# EAGLE schematic EZFOC_V1 (EAGLE 9.6.2)
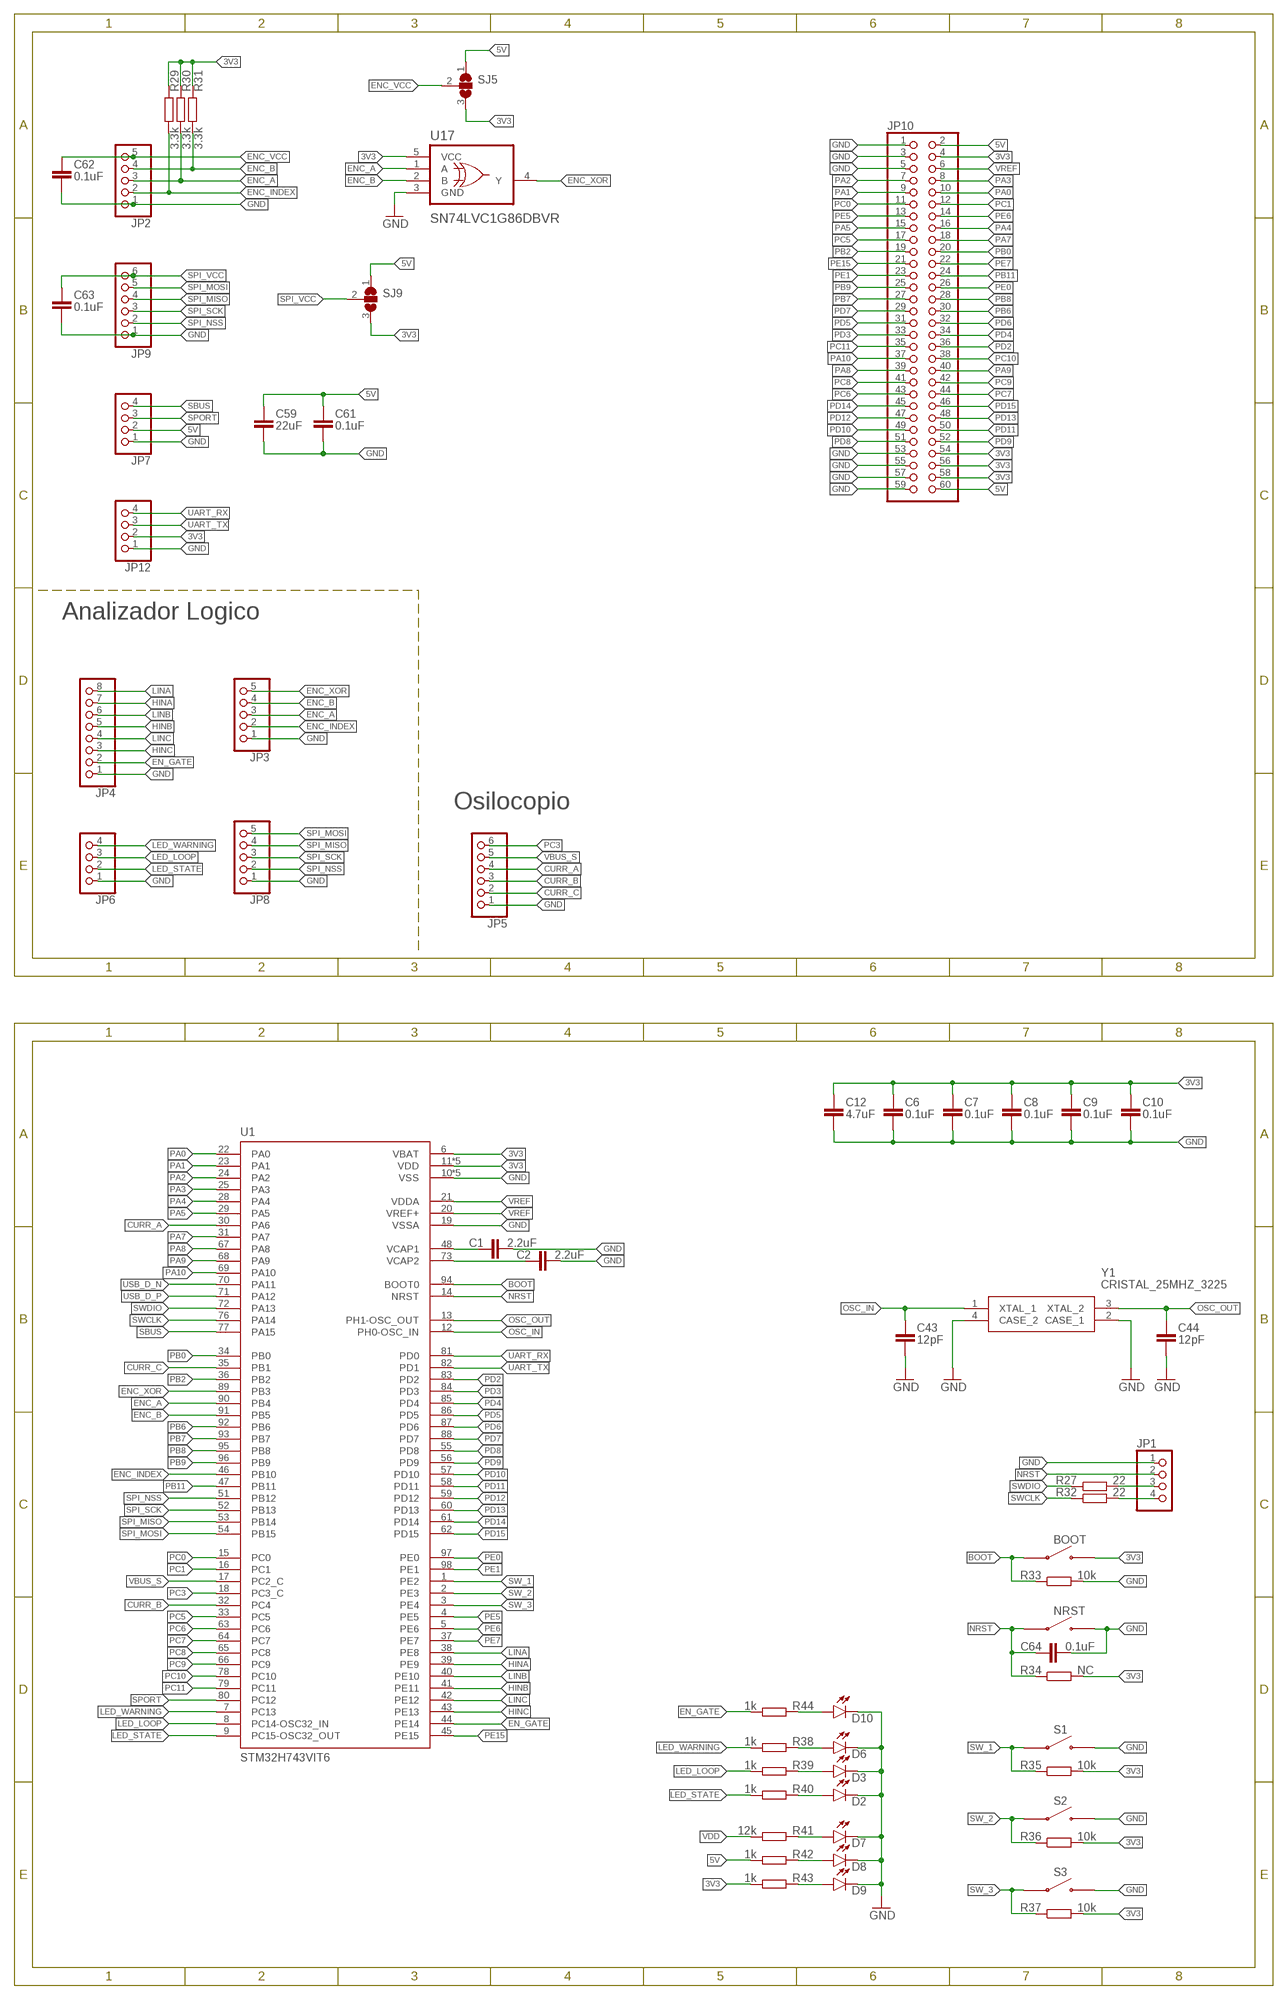
[diagram p0: schematic, sheet 1, part 1 of 2]
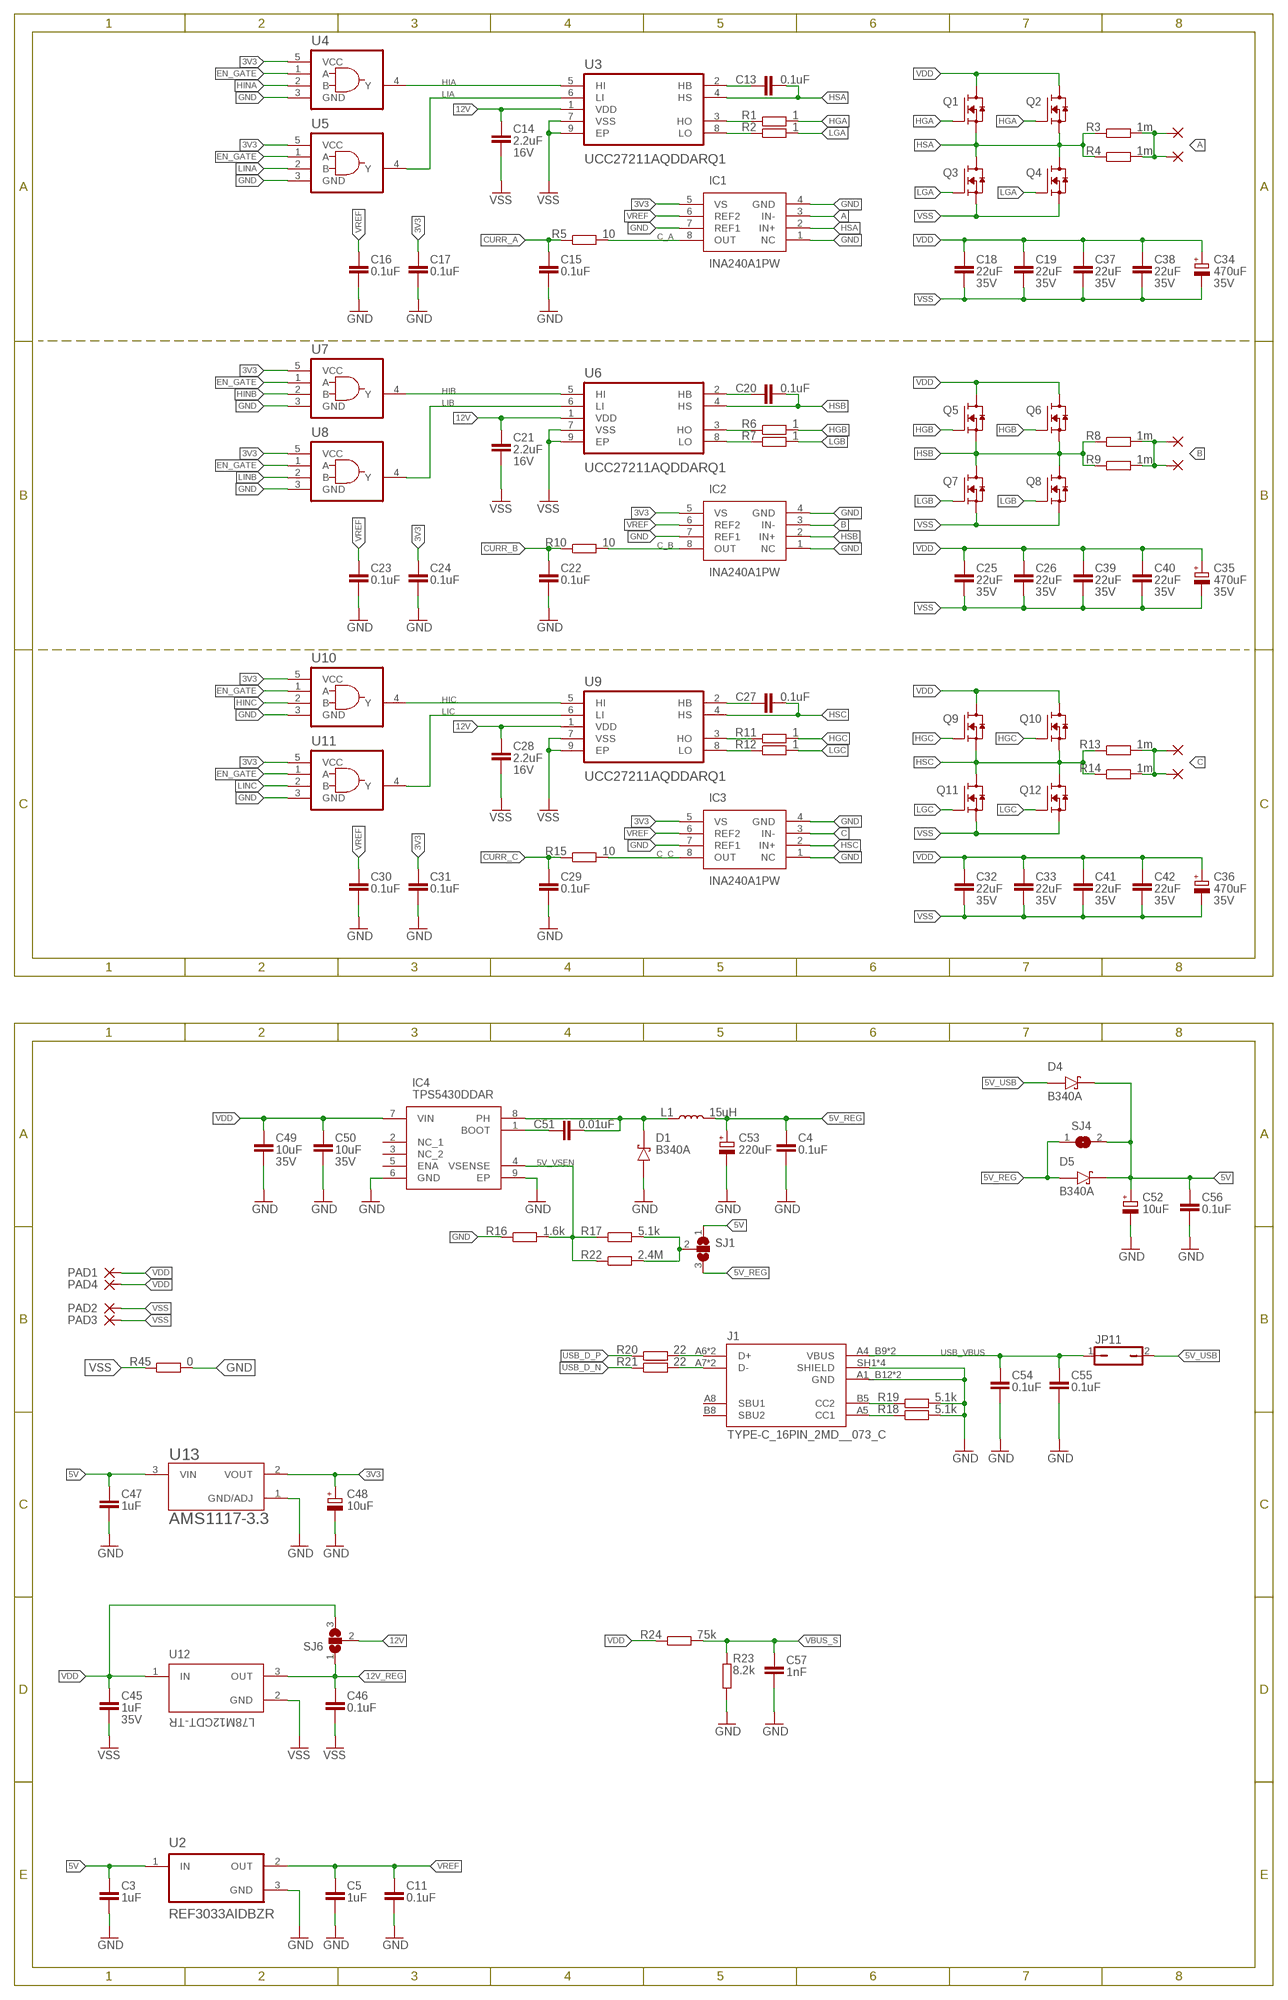
[diagram p1: schematic, sheet 1, part 2 of 2]

## Parts
A  PAD1.27X2.54  [SMD1,27-2,54]
A1  PAD1.27X2.54  [SMD1,27-2,54]
B  PAD1.27X2.54  [SMD1,27-2,54]
B1  PAD1.27X2.54  [SMD1,27-2,54]
BOOT  TS-1088  [SKRKAEE020]
C  PAD1.27X2.54  [SMD1,27-2,54]
C1  2.2uF  C_CHIP-0603(1608-METRIC)  [0603]
C2  2.2uF  C_CHIP-0603(1608-METRIC)  [0603]
C3  1uF  C_CHIP-0603(1608-METRIC)  [0603]
C4  0.1uF  C_CHIP-0402(1005-METRIC)  [0402]
C5  1uF  C_CHIP-0603(1608-METRIC)  [0603]
C6  0.1uF  C_CHIP-0402(1005-METRIC)  [0402]
C7  0.1uF  C_CHIP-0402(1005-METRIC)  [0402]
C8  0.1uF  C_CHIP-0402(1005-METRIC)  [0402]
C9  0.1uF  C_CHIP-0402(1005-METRIC)  [0402]
C10  0.1uF  C_CHIP-0402(1005-METRIC)  [0402]
C11  0.1uF  C_CHIP-0402(1005-METRIC)  [0402]
C12  4.7uF  C_CHIP-0603(1608-METRIC)  [0603]
C13  0.1uF  C_CHIP-0603(1608-METRIC)  [0603]
C14  2.2uF  C_CHIP-0603(1608-METRIC)  [0603]
C15  0.1uF  C_CHIP-0402(1005-METRIC)  [0402]
C16  0.1uF  C_CHIP-0402(1005-METRIC)  [0402]
C17  0.1uF  C_CHIP-0402(1005-METRIC)  [0402]
C18  22uF  C_CHIP-1206(3216-METRIC)  [1206]
C19  22uF  C_CHIP-1206(3216-METRIC)  [1206]
C20  0.1uF  C_CHIP-0603(1608-METRIC)  [0603]
C21  2.2uF  C_CHIP-0603(1608-METRIC)  [0603]
C22  0.1uF  C_CHIP-0402(1005-METRIC)  [0402]
C23  0.1uF  C_CHIP-0402(1005-METRIC)  [0402]
C24  0.1uF  C_CHIP-0402(1005-METRIC)  [0402]
C25  22uF  C_CHIP-1206(3216-METRIC)  [1206]
C26  22uF  C_CHIP-1206(3216-METRIC)  [1206]
C27  0.1uF  C_CHIP-0603(1608-METRIC)  [0603]
C28  2.2uF  C_CHIP-0603(1608-METRIC)  [0603]
C29  0.1uF  C_CHIP-0402(1005-METRIC)  [0402]
C30  0.1uF  C_CHIP-0402(1005-METRIC)  [0402]
C31  0.1uF  C_CHIP-0402(1005-METRIC)  [0402]
C32  22uF  C_CHIP-1206(3216-METRIC)  [1206]
C33  22uF  C_CHIP-1206(3216-METRIC)  [1206]
C34  470uF  C-POL_ECAP-10.5MM  [CAPAE1030X1050N]
C35  470uF  C-POL_ECAP-10.5MM  [CAPAE1030X1050N]
C36  470uF  C-POL_ECAP-10.5MM  [CAPAE1030X1050N]
C37  22uF  C_CHIP-1206(3216-METRIC)  [1206]
C38  22uF  C_CHIP-1206(3216-METRIC)  [1206]
C39  22uF  C_CHIP-1206(3216-METRIC)  [1206]
C40  22uF  C_CHIP-1206(3216-METRIC)  [1206]
C41  22uF  C_CHIP-1206(3216-METRIC)  [1206]
C42  22uF  C_CHIP-1206(3216-METRIC)  [1206]
C43  12pF  C_CHIP-0402(1005-METRIC)  [0402]
C44  12pF  C_CHIP-0402(1005-METRIC)  [0402]
C45  1uF  C_CHIP-0603(1608-METRIC)  [0603]
C46  0.1uF  C_CHIP-0402(1005-METRIC)  [0402]
C47  1uF  C_CHIP-0603(1608-METRIC)  [0603]
C48  10uF  C-POL_TANTALUM-1206(3216-METRIC)  [CAPMP3216X180N]
C49  10uF  C_CHIP-0805(2012-METRIC)  [0805]
C50  10uF  C_CHIP-0805(2012-METRIC)  [0805]
C51  0.01uF  C_CHIP-0603(1608-METRIC)  [0603]
C52  10uF  C-POL_TANTALUM-1206(3216-METRIC)  [CAPMP3216X180N]
C53  220uF  C-POL_ECAP-6.3MM  [CAPAE660X800N]
C54  0.1uF  C_CHIP-0402(1005-METRIC)  [0402]
C55  0.1uF  C_CHIP-0402(1005-METRIC)  [0402]
C56  0.1uF  C_CHIP-0402(1005-METRIC)  [0402]
C57  1nF  C_CHIP-0402(1005-METRIC)  [0402]
C59  22uF  C_CHIP-1206(3216-METRIC)  [1206]
C61  0.1uF  C_CHIP-0402(1005-METRIC)  [0402]
C62  0.1uF  C_CHIP-0402(1005-METRIC)  [0402]
C63  0.1uF  C_CHIP-0402(1005-METRIC)  [0402]
C64  0.1uF  C_CHIP-0402(1005-METRIC)  [0402]
C65  PAD1.27X2.54  [SMD1,27-2,54]
D1  B340A  B340A-13-F  [DIOM5226X240N]
D2  LED_BLUE  CHIP-FLAT-B_0805  [LEDC2012X110N_FLAT-B]
D3  LED_BLUE  CHIP-FLAT-B_0805  [LEDC2012X110N_FLAT-B]
D4  B340A  B340A-13-F  [DIOM5226X240N]
D5  B340A  B340A-13-F  [DIOM5226X240N]
D6  LED_BLUE  CHIP-FLAT-B_0805  [LEDC2012X110N_FLAT-B]
D7  LED_BLUE  CHIP-FLAT-B_0805  [LEDC2012X110N_FLAT-B]
D8  LED_BLUE  CHIP-FLAT-B_0805  [LEDC2012X110N_FLAT-B]
D9  LED_BLUE  CHIP-FLAT-B_0805  [LEDC2012X110N_FLAT-B]
D10  LED_BLUE  CHIP-FLAT-B_0805  [LEDC2012X110N_FLAT-B]
IC1  INA240A1PW  [SOP65P640X120-8N]
IC2  INA240A1PW  [SOP65P640X120-8N]
IC3  INA240A1PW  [SOP65P640X120-8N]
IC4  TPS5430DDAR  [SOIC127P600X170-9N]
J1  TYPE-C_16PIN_2MD__073_C  [GCT_USB4105-GF-A]
JP1  PINHD-1X4  [1X04]
JP2  PINHD-1X5  [1X05]
JP3  PINHD-1X5  [1X05]
JP4  PINHD-1X8  [1X08]
JP5  PINHD-1X6  [1X06]
JP6  PINHD-1X4  [1X04]
JP7  PINHD-1X4  [1X04]
JP8  PINHD-1X5  [1X05]
JP9  PINHD-1X6  [1X06]
JP10  PINHD-2X30  [2X30]
JP11  JP1Q  [JP1]
JP12  PINHD-1X4  [1X04]
L1  15uH  LSMD6.6X7.3MM  [SMD6.6X7.3MM]
NRST  TS-1088  [SKRKAEE020]
PAD1  PAD2.54X5.08  [SMD2,54-5,08]
PAD2  PAD2.54X5.08  [SMD2,54-5,08]
PAD3  PAD2.54X5.08  [SMD2,54-5,08]
PAD4  PAD2.54X5.08  [SMD2,54-5,08]
Q1  BSC011N03LSI_FL  [TDSON-8FL]
Q2  BSC011N03LSI_FL  [TDSON-8FL]
Q3  BSC011N03LSI_FL  [TDSON-8FL]
Q4  BSC011N03LSI_FL  [TDSON-8FL]
Q5  BSC011N03LSI_FL  [TDSON-8FL]
Q6  BSC011N03LSI_FL  [TDSON-8FL]
Q7  BSC011N03LSI_FL  [TDSON-8FL]
Q8  BSC011N03LSI_FL  [TDSON-8FL]
Q9  BSC011N03LSI_FL  [TDSON-8FL]
Q10  BSC011N03LSI_FL  [TDSON-8FL]
Q11  BSC011N03LSI_FL  [TDSON-8FL]
Q12  BSC011N03LSI_FL  [TDSON-8FL]
R1  1  R_CHIP-0603(1608-METRIC)  [0603]
R2  1  R_CHIP-0603(1608-METRIC)  [0603]
R3  1m  R_CHIP-2512(6332-METRIC)  [2512]
R4  1m  R_CHIP-2512(6332-METRIC)  [2512]
R5  10  R_CHIP-0402(1005-METRIC)  [0402]
R6  1  R_CHIP-0603(1608-METRIC)  [0603]
R7  1  R_CHIP-0603(1608-METRIC)  [0603]
R8  1m  R_CHIP-2512(6332-METRIC)  [2512]
R9  1m  R_CHIP-2512(6332-METRIC)  [2512]
R10  10  R_CHIP-0402(1005-METRIC)  [0402]
R11  1  R_CHIP-0603(1608-METRIC)  [0603]
R12  1  R_CHIP-0603(1608-METRIC)  [0603]
R13  1m  R_CHIP-2512(6332-METRIC)  [2512]
R14  1m  R_CHIP-2512(6332-METRIC)  [2512]
R15  10  R_CHIP-0402(1005-METRIC)  [0402]
R16  1.6k  R_CHIP-0603(1608-METRIC)  [0603]
R17  5.1k  R_CHIP-0603(1608-METRIC)  [0603]
R18  5.1k  R_CHIP-0603(1608-METRIC)  [0603]
R19  5.1k  R_CHIP-0603(1608-METRIC)  [0603]
R20  22  R_CHIP-0402(1005-METRIC)  [0402]
R21  22  R_CHIP-0402(1005-METRIC)  [0402]
R22  2.4M  R_CHIP-0603(1608-METRIC)  [0603]
R23  8.2k  R_CHIP-0603(1608-METRIC)  [0603]
R24  75k  R_CHIP-0603(1608-METRIC)  [0603]
R27  22  R_CHIP-0402(1005-METRIC)  [0402]
R29  3.3k  R_CHIP-0402(1005-METRIC)  [0402]
R30  3.3k  R_CHIP-0402(1005-METRIC)  [0402]
R31  3.3k  R_CHIP-0402(1005-METRIC)  [0402]
R32  22  R_CHIP-0402(1005-METRIC)  [0402]
R33  10k  R_CHIP-0402(1005-METRIC)  [0402]
R34  NC  R_CHIP-0402(1005-METRIC)  [0402]
R35  10k  R_CHIP-0402(1005-METRIC)  [0402]
R36  10k  R_CHIP-0402(1005-METRIC)  [0402]
R37  10k  R_CHIP-0402(1005-METRIC)  [0402]
R38  1k  R_CHIP-0402(1005-METRIC)  [0402]
R39  1k  R_CHIP-0402(1005-METRIC)  [0402]
R40  1k  R_CHIP-0402(1005-METRIC)  [0402]
R41  12k  R_CHIP-0402(1005-METRIC)  [0402]
R42  1k  R_CHIP-0402(1005-METRIC)  [0402]
R43  1k  R_CHIP-0402(1005-METRIC)  [0402]
R44  1k  R_CHIP-0402(1005-METRIC)  [0402]
R45  0  R_CHIP-1206(3216-METRIC)  [1206]
S1  TS-1088  [SKRKAEE020]
S2  TS-1088  [SKRKAEE020]
S3  TS-1088  [SKRKAEE020]
SJ1  SJ2W  [SJ_2]
SJ4  SJ  [SJ]
SJ5  SJ2W  [SJ_2]
SJ6  SJ2W  [SJ_2]
SJ9  SJ2W  [SJ_2]
U1  STM32H743VIT6  [LQFP100]
U2  REF3033AIDBZR  [SOT95P237X112-3N]
U3  UCC27211AQDDARQ1  [SOIC127P600X170-9N]
U4  SN74LVC1G08DBVR  [SOT95P280X145-5N]
U5  SN74LVC1G08DBVR  [SOT95P280X145-5N]
U6  UCC27211AQDDARQ1  [SOIC127P600X170-9N]
U7  SN74LVC1G08DBVR  [SOT95P280X145-5N]
U8  SN74LVC1G08DBVR  [SOT95P280X145-5N]
U9  UCC27211AQDDARQ1  [SOIC127P600X170-9N]
U10  SN74LVC1G08DBVR  [SOT95P280X145-5N]
U11  SN74LVC1G08DBVR  [SOT95P280X145-5N]
U12  L78M12CDT-TR  [VREG_L78M12CDT-TR]
U13  AMS1117-3.3  [SOT229P700X180-4N]
U17  SN74LVC1G86DBVR  [SOT95P280X145-5N]
Y1  CRISTAL_25MHZ_3225  [SMD3225-4P]

## Nets
3V3: BOOT.2 C6.1 C7.1 C8.1 C9.1 C10.1 C12.1 C17.1 C24.1 C31.1 C48.1(+) IC1.5(VS) IC2.5(VS) IC3.5(VS) JP10.4 JP10.54 JP10.56 JP10.58 JP12.2 R29.1 R30.1 R31.1 R34.2 R35.2 R36.2 R37.2 R43.2 SJ5.3 SJ9.3 U1.6(VBAT) U1.11(VDD) U1.27(VDD) U1.50(VDD) U1.75(VDD) U1.100(VDD) U4.5(VCC) U5.5(VCC) U7.5(VCC) U8.5(VCC) U10.5(VCC) U11.5(VCC) U13.2(VOUT) U17.5(VCC)
5V: C3.1 C47.1 C52.1(+) C56.1 C59.1 C61.1 D4.C D5.C JP7.2 JP10.2 JP10.60 R42.2 SJ1.1 SJ4.2 SJ5.1 SJ9.1 U2.1(IN) U13.3(VIN)
5V_REG: C4.1 C53.1(+) D5.A L1.2 SJ1.3 SJ4.1
5V_USB: D4.A JP11.2
5V_VSEN: IC4.4(VSENSE) R16.2 R17.1 R22.1
12V: C14.1 C21.1 C28.1 SJ6.2 U3.1(VDD) U6.1(VDD) U9.1(VDD)
12V_REG: C46.1 SJ6.1 U12.3(OUT)
A: A1.1(P) A.1(P) IC1.3(IN-) R3.2 R4.2
B: B1.1(P) B.1(P) IC2.3(IN-) R8.2 R9.2
BOOT [signal]: BOOT.1 R33.1 U1.94(BOOT0)
C: C65.1(P) C.1(P) IC3.3(IN-) R13.2 R14.2
C_A: IC1.8(OUT) R5.2
C_B: IC2.8(OUT) R10.2
C_C: IC3.8(OUT) R15.2
CURR_A: C15.1 JP5.4 R5.1 U1.30(PA6)
CURR_B: C22.1 JP5.3 R10.1 U1.32(PC4)
CURR_C: C29.1 JP5.2 R15.1 U1.35(PB1)
EN_GATE [signal]: JP4.2 R44.2 U1.44(PE14) U4.1(A) U5.1(A) U7.1(A) U8.1(A) U10.1(A) U11.1(A)
EN_GATE_R [signal]: D10.A R44.1
ENC_A [signal]: JP2.3 JP3.3 R30.2 U1.90(PB4) U17.1(A)
ENC_B [signal]: JP2.4 JP3.4 R31.2 U1.91(PB5) U17.2(B)
ENC_INDEX [signal]: JP2.2 JP3.2 R29.2 U1.46(PB10)
ENC_VCC [signal]: C62.1 JP2.5 SJ5.2
ENC_XOR [signal]: JP3.5 U1.89(PB3) U17.4(Y)
GND: C1.2 C2.2 C3.2 C4.2 C5.2 C6.2 C7.2 C8.2 C9.2 C10.2 C11.2 C12.2 C15.2 C16.2 C17.2 C22.2 C23.2 C24.2 C29.2 C30.2 C31.2 C43.2 C44.2 C47.2 C48.2(-) C49.2 C50.2 C52.2(-) C53.2(-) C54.2 C55.2 C56.2 C57.2 C59.2 C61.2 C62.2 C63.2 C64.2 D1.A D2.C D3.C D6.C D7.C D8.C D9.C D10.C IC1.1(NC) IC1.4(GND) IC1.7(REF1) IC2.1(NC) IC2.4(GND) IC2.7(REF1) IC3.1(NC) IC3.4(GND) IC3.7(REF1) IC4.6(GND) IC4.9(EP) J1.A1_B12(GND) J1.B1_A12(GND) J1.SH1(SHIELD) J1.SH2(SHIELD) J1.SH3(SHIELD) J1.SH4(SHIELD) JP1.1 JP2.1 JP3.1 JP4.1 JP5.1 JP6.1 JP7.1 JP8.1 JP9.1 JP10.1 JP10.3 JP10.5 JP10.53 JP10.55 JP10.57 JP10.59 JP12.1 NRST.2 R16.1 R18.2 R19.2 R23.1 R33.2 R45.2 S1.2 S2.2 S3.2 U1.10(VSS) U1.19(VSSA) U1.26(VSS) U1.49(VSS) U1.74(VSS) U1.99(VSS) U2.3(GND) U4.3(GND) U5.3(GND) U7.3(GND) U8.3(GND) U10.3(GND) U11.3(GND) U13.1(GND/ADJ) U17.3(GND) Y1.2(CASE_1) Y1.4(CASE_2)
HBA: C13.1 U3.2(HB)
HBB: C20.1 U6.2(HB)
HBC: C27.1 U9.2(HB)
HGA: Q1.4(G) Q2.4(G) R1.2
HGB: Q5.4(G) Q6.4(G) R6.2
HGC: Q9.4(G) Q10.4(G) R11.2
HIA: U3.5(HI) U4.4(Y)
HIB: U6.5(HI) U7.4(Y)
HIC: U9.5(HI) U10.4(Y)
HINA [signal]: JP4.7 U1.39(PE9) U4.2(B)
HINB [signal]: JP4.5 U1.41(PE11) U7.2(B)
HINC [signal]: JP4.3 U1.43(PE13) U10.2(B)
HOA: R1.1 U3.3(HO)
HOB: R6.1 U6.3(HO)
HOC: R11.1 U9.3(HO)
HSA: C13.2 IC1.2(IN+) Q1.1(S) Q1.2(S) Q1.3(S) Q1.10(S) Q2.1(S) Q2.2(S) Q2.3(S) Q2.10(S) Q3.5(D) Q3.6(D) Q3.7(D) Q3.8(D) Q3.9(D) Q4.5(D) Q4.6(D) Q4.7(D) Q4.8(D) Q4.9(D) R3.1 R4.1 U3.4(HS)
HSB: C20.2 IC2.2(IN+) Q5.1(S) Q5.2(S) Q5.3(S) Q5.10(S) Q6.1(S) Q6.2(S) Q6.3(S) Q6.10(S) Q7.5(D) Q7.6(D) Q7.7(D) Q7.8(D) Q7.9(D) Q8.5(D) Q8.6(D) Q8.7(D) Q8.8(D) Q8.9(D) R8.1 R9.1 U6.4(HS)
HSC: C27.2 IC3.2(IN+) Q9.1(S) Q9.2(S) Q9.3(S) Q9.10(S) Q10.1(S) Q10.2(S) Q10.3(S) Q10.10(S) Q11.5(D) Q11.6(D) Q11.7(D) Q11.8(D) Q11.9(D) Q12.5(D) Q12.6(D) Q12.7(D) Q12.8(D) Q12.9(D) R13.1 R14.1 U9.4(HS)
LED1R [signal]: D6.A R38.1
LED2R [signal]: D3.A R39.1
LED3R [signal]: D2.A R40.1
LED4R [signal]: D7.A R41.1
LED5R [signal]: D8.A R42.1
LED6R [signal]: D9.A R43.1
LED_LOOP [signal]: JP6.3 R39.2 U1.8(PC14-OSC32_IN)
LED_STATE [signal]: JP6.2 R40.2 U1.9(PC15-OSC32_OUT)
LED_WARNING [signal]: JP6.4 R38.2 U1.7(PC13)
LGA: Q3.4(G) Q4.4(G) R2.2
LGB: Q7.4(G) Q8.4(G) R7.2
LGC: Q11.4(G) Q12.4(G) R12.2
LIA: U3.6(LI) U5.4(Y)
LIB: U6.6(LI) U8.4(Y)
LIC: U9.6(LI) U11.4(Y)
LINA [signal]: JP4.8 U1.38(PE8) U5.2(B)
LINB [signal]: JP4.6 U1.40(PE10) U8.2(B)
LINC [signal]: JP4.4 U1.42(PE12) U11.2(B)
LOA: R2.1 U3.8(LO)
LOB: R7.1 U6.8(LO)
LOC: R12.1 U9.8(LO)
NRST [signal]: C64.1 JP1.2 NRST.1 R34.1 U1.14(NRST)
OSC_IN: C43.1 U1.12(PH0-OSC_IN) Y1.1(XTAL_1)
OSC_OUT: C44.1 U1.13(PH1-OSC_OUT) Y1.3(XTAL_2)
PA0: JP10.10 U1.22(PA0)
PA1: JP10.9 U1.23(PA1)
PA2: JP10.7 U1.24(PA2)
PA3: JP10.8 U1.25(PA3)
PA4: JP10.16 U1.28(PA4)
PA5: JP10.15 U1.29(PA5)
PA7: JP10.18 U1.31(PA7)
PA8: JP10.39 U1.67(PA8)
PA9: JP10.40 U1.68(PA9)
PA10: JP10.37 U1.69(PA10)
PB0: JP10.20 U1.34(PB0)
PB2: JP10.19 U1.36(PB2)
PB6: JP10.30 U1.92(PB6)
PB7: JP10.27 U1.93(PB7)
PB8: JP10.28 U1.95(PB8)
PB9: JP10.25 U1.96(PB9)
PB11: JP10.24 U1.47(PB11)
PC0: JP10.11 U1.15(PC0)
PC1: JP10.12 U1.16(PC1)
PC3: JP5.6 U1.18(PC3_C)
PC5: JP10.17 U1.33(PC5)
PC6: JP10.43 U1.63(PC6)
PC7: JP10.44 U1.64(PC7)
PC8: JP10.41 U1.65(PC8)
PC9: JP10.42 U1.66(PC9)
PC10: JP10.38 U1.78(PC10)
PC11: JP10.35 U1.79(PC11)
PD2: JP10.36 U1.83(PD2)
PD3: JP10.33 U1.84(PD3)
PD4: JP10.34 U1.85(PD4)
PD5: JP10.31 U1.86(PD5)
PD6: JP10.32 U1.87(PD6)
PD7: JP10.29 U1.88(PD7)
PD8: JP10.51 U1.55(PD8)
PD9: JP10.52 U1.56(PD9)
PD10: JP10.49 U1.57(PD10)
PD11: JP10.50 U1.58(PD11)
PD12: JP10.47 U1.59(PD12)
PD13: JP10.48 U1.60(PD13)
PD14: JP10.45 U1.61(PD14)
PD15: JP10.46 U1.62(PD15)
PE0: JP10.26 U1.97(PE0)
PE1: JP10.23 U1.98(PE1)
PE5: JP10.13 U1.4(PE5)
PE6: JP10.14 U1.5(PE6)
PE7: JP10.22 U1.37(PE7)
PE15: JP10.21 U1.45(PE15)
REG_BOOT: C51.1 IC4.1(BOOT)
REG_PH: C51.2 D1.C IC4.8(PH) L1.1
SBUS: JP7.4 U1.77(PA15)
SJ1_SEL: R17.2 R22.2 SJ1.2
SPI_MISO [signal]: JP8.4 JP9.4 U1.53(PB14)
SPI_MOSI [signal]: JP8.5 JP9.5 U1.54(PB15)
SPI_NSS [signal]: JP8.2 JP9.2 U1.51(PB12)
SPI_SCK [signal]: JP8.3 JP9.3 U1.52(PB13)
SPI_VCC [signal]: C63.1 JP9.6 SJ9.2
SPORT [signal]: JP7.3 U1.80(PC12)
SW_1 [signal]: R35.1 S1.1 U1.1(PE2)
SW_2 [signal]: R36.1 S2.1 U1.2(PE3)
SW_3 [signal]: R37.1 S3.1 U1.3(PE4)
SWCLK: R32.1 U1.76(PA14)
SWCLK_R [signal]: JP1.4 R32.2
SWDIO: R27.1 U1.72(PA13)
SWDIO_R [signal]: JP1.3 R27.2
UART_RX [signal]: JP12.4 U1.81(PD0)
UART_TX [signal]: JP12.3 U1.82(PD1)
USB_CC1: J1.B5(CC2) R19.1
USB_CC2: J1.A5(CC1) R18.1
USB_D_N: R21.1 U1.70(PA11)
USB_D_P: R20.1 U1.71(PA12)
USB_DN_R: J1.A7(D-) J1.B7(D-) R21.2
USB_DP_R: J1.A6(D+) J1.B6(D+) R20.2
USB_VBUS: C54.1 C55.1 J1.A4_B9(VBUS) J1.B4_A9(VBUS) JP11.1
VBUS_S: C57.1 JP5.5 R23.2 R24.2 U1.17(PC2_C)
VCAP1: C1.1 U1.48(VCAP1)
VCAP2: C2.1 U1.73(VCAP2)
VDD: C18.1 C19.1 C25.1 C26.1 C32.1 C33.1 C34.1(+) C35.1(+) C36.1(+) C37.1 C38.1 C39.1 C40.1 C41.1 C42.1 C45.1 C49.1 C50.1 IC4.7(VIN) PAD1.1(P) PAD4.1(P) Q1.5(D) Q1.6(D) Q1.7(D) Q1.8(D) Q1.9(D) Q2.5(D) Q2.6(D) Q2.7(D) Q2.8(D) Q2.9(D) Q5.5(D) Q5.6(D) Q5.7(D) Q5.8(D) Q5.9(D) Q6.5(D) Q6.6(D) Q6.7(D) Q6.8(D) Q6.9(D) Q9.5(D) Q9.6(D) Q9.7(D) Q9.8(D) Q9.9(D) Q10.5(D) Q10.6(D) Q10.7(D) Q10.8(D) Q10.9(D) R24.1 R41.2 SJ6.3 U12.1(IN)
VREF: C5.1 C11.1 C16.1 C23.1 C30.1 IC1.6(REF2) IC2.6(REF2) IC3.6(REF2) JP10.6 U1.20(VREF+) U1.21(VDDA) U2.2(OUT)
VSS: C14.2 C18.2 C19.2 C21.2 C25.2 C26.2 C28.2 C32.2 C33.2 C34.2(-) C35.2(-) C36.2(-) C37.2 C38.2 C39.2 C40.2 C41.2 C42.2 C45.2 C46.2 PAD2.1(P) PAD3.1(P) Q3.1(S) Q3.2(S) Q3.3(S) Q3.10(S) Q4.1(S) Q4.2(S) Q4.3(S) Q4.10(S) Q7.1(S) Q7.2(S) Q7.3(S) Q7.10(S) Q8.1(S) Q8.2(S) Q8.3(S) Q8.10(S) Q11.1(S) Q11.2(S) Q11.3(S) Q11.10(S) Q12.1(S) Q12.2(S) Q12.3(S) Q12.10(S) R45.1 U3.7(VSS) U3.9(EP) U6.7(VSS) U6.9(EP) U9.7(VSS) U9.9(EP) U12.2(GND)
Unconnected: IC4.2(NC_1) IC4.3(NC_2) IC4.5(ENA) J1.A8(SBU1) J1.B8(SBU2)

## Notes on the sheet
- Analizador Logico
- Osilocopio

## Library data of the parts
A A1 B B1 C C65 PAD1-PAD4 = wirepad_edit:PAD
BOOT NRST S1-S3 = TS-1088:TS-1088: Tactile Switches 3.9x2.9x2.0mm 160gf Packaging Temp 80oC Source: Datasheet <http://www.alps.com/prod/info/J/HTML/Tact/SurfaceMount/SKRK/SKRKAEE020.html>; DESCRIPTION: Tactile Switches 3.9x2.9x2.0mm 160gf Packaging Temp 80oC; HEIGHT: 2mm; JLCPCB: C720477; MANUFACTURER_NAME: ALPS Electric; MANUFACTURER_PART_NUMBER: SKRKAEE020; MOUSER_PART_NUMBER: 688-SKRKAEE020; MOUSER_PRICE-STOCK: https://www.mouser.co.uk/ProductDetail/Alps-Alpine/SKRKAEE020?qs=MrosSN5%252BUQW89XjXIp8Ugw%3D%3D
C1 C2 C4 C6-C12 C15-C17 C22-C24 C29-C31 C43 C44 C46 C51 C54-C57 C61-C64 = 01_SMD_RLC:C: Capacitor - Generic; CATEGORY: Capacitor
C3 C5 C13 C18-C20 C25-C27 C32 C33 C37-C42 C45 C47 C49 C50 C59 = 01_SMD_RLC:C: Capacitor - Generic; CATEGORY: Capacitor; VOLTAGE_RATING: 35V
C14 C21 C28 = 01_SMD_RLC:C: Capacitor - Generic; CATEGORY: Capacitor; VOLTAGE_RATING: 16V
C34-C36 = 01_SMD_RLC:C-POL: Capacitor Polarised - Generic; CATEGORY: Capacitor; JLCPCB: C2980172; VOLTAGE_RATING: 35V
C48 C52 = 01_SMD_RLC:C-POL: Capacitor Polarised - Generic; CATEGORY: Capacitor; JLCPCB: C7171
C53 = 01_SMD_RLC:C-POL: Capacitor Polarised - Generic; JLCPCB: C72494
D1 D4 D5 = B340A-13-F:B340A-13-F: Diode, Rectifier, 3a, 40v, Do-214ac, Full Reel Check availability <https://pricing.snapeda.com/parts/B340A-13-F/Diodes%20Inc./view-part?ref=eda>; AVAILABILITY: In Stock; CHECK_PRICES: https://www.snapeda.com/parts/B340A-13-F/Diodes+Inc./view-part/?ref=eda; DESCRIPTION: Schottky Diode 3A 40V 0.5Vf SMA | Diodes Inc B340A-13-F; JLCPCB: C8678; MF: Diodes Inc.; MP: B340A-13-F; PACKAGE: DO-214 Diodes Inc.; PRICE: None; SNAPEDA_LINK: https://www.snapeda.com/parts/B340A-13-F/Diodes+Inc./view-part/?ref=snap
D2 D3 = LED:CHIP-FLAT-B; CATEGORY: LED; COLOR: BLUE; DESCRIPTION: CHIP LED FLAT; JLCPCB: C965817; SUB-CATEGORY: CHIP; TYPE: FLAT_TOP
D6 = LED:CHIP-FLAT-B; CATEGORY: LED; COLOR: Yellow; DESCRIPTION: CHIP LED FLAT; JLCPCB: C2296; SUB-CATEGORY: CHIP; TYPE: FLAT_TOP
D7-D9 = LED:CHIP-FLAT-B; CATEGORY: LED; COLOR: BLUE; DESCRIPTION: CHIP LED FLAT; JLCPCB: C84256; SUB-CATEGORY: CHIP; TYPE: FLAT_TOP
D10 = LED:CHIP-FLAT-B; CATEGORY: LED; COLOR: BLUE; DESCRIPTION: CHIP LED FLAT; JLCPCB: C2297; SUB-CATEGORY: CHIP; TYPE: FLAT_TOP
IC1-IC3 = INA240A1PW:INA240A1PW: Current Sense Amplifiers Voltage Output, High or Low Side Measurement, Bi-Directional Zer?-Drift Series 8-TSSOP -40 to 125 Source: Datasheet <http://www.ti.com/general/docs/lit/getliterature.tsp?genericPartNumber=ina240&fileType=pdf>; DESCRIPTION: Current Sense Amplifiers Voltage Output, High or Low Side Measurement, Bi-Directional Zer?-Drift Series 8-TSSOP -40 to 125; HEIGHT: 1.2mm; JLCPCB: C93965; MANUFACTURER_NAME: Texas Instruments; MANUFACTURER_PART_NUMBER: INA240A1PW; MOUSER_PART_NUMBER: 595-INA240A1PW; MOUSER_PRICE-STOCK: https://www.mouser.co.uk/ProductDetail/Texas-Instruments/INA240A1PW?qs=aVyJF2WnouQ4CUqAxLDbhw%3D%3D
IC4 = TPS5430DDAR:TPS5430DDAR: Texas Instruments, TPS5430DDAR Step-Down Switching Regulator 3A Adjustable, 1.22 31 V, 8-Pin SOIC Source: Datasheet <http://www.ti.com/lit/gpn/tps5430>; DESCRIPTION: Texas Instruments, TPS5430DDAR Step-Down Switching Regulator 3A Adjustable, 1.22 31 V, 8-Pin SOIC; HEIGHT: 1.7mm; JLCPCB: C9864; MANUFACTURER_NAME: Texas Instruments; MANUFACTURER_PART_NUMBER: TPS5430DDAR; MOUSER_PART_NUMBER: 595-TPS5430DDAR; MOUSER_PRICE-STOCK: https://www.mouser.co.uk/ProductDetail/Texas-Instruments/TPS5430DDAR?qs=zwk82MlA57ZJdOTovH1aYA%3D%3D
J1 = TYPE-C_16PIN_2MD__073_:TYPE-C_16PIN_2MD__073_: Check availability <https://pricing.snapeda.com/parts/TYPE-C%2016PIN%202MD%20%28073%29/Shouhan/view-part?ref=eda>
JP1 JP6 JP7 JP12 = pinhead:PINHD-1X4: PIN HEADER
JP2 JP3 JP8 = pinhead:PINHD-1X5: PIN HEADER
JP4 = pinhead:PINHD-1X8: PIN HEADER
JP5 JP9 = pinhead:PINHD-1X6: PIN HEADER
JP10 = pinhead:PINHD-2X30: PIN HEADER
JP11 = jumper:JP1Q: JUMPER
L1 = 01_SMD_RLC:L: Resistor Fixed - Generic; JLCPCB: C2847544
Q1-Q12 = 02_Mosfets:BSC011N03LSI_FL; JLCPCB: C534283
R1 R2 R5-R7 R10-R12 R15-R24 R27 R29-R44 = 01_SMD_RLC:R: Resistor Fixed - Generic; CATEGORY: Resistor; SUB-CATEGORY: Fixed
R3 R4 R8 R9 R13 R14 = 01_SMD_RLC:R: Resistor Fixed - Generic; CATEGORY: Resistor; JLCPCB: C7370895; SUB-CATEGORY: Fixed
R45 = 01_SMD_RLC:R: Resistor Fixed - Generic; CATEGORY: Resistor; JLCPCB: C17888; SUB-CATEGORY: Fixed
SJ1 SJ5 SJ6 SJ9 = jumper:SJ2W: SMD solder JUMPER
SJ4 = jumper:SJ: SMD solder JUMPER
U1 = 03_IC:STM32H743VIT6: ARM® Cortex®-M7 STM32H7 Microcontroller IC 32-Bit 480MHz 2MB (2M x 8) FLASH 100-LQFP (14x14) Check availability <https://pricing.snapeda.com/parts/STM32H743VIT6/STMicroelectronics/view-part?ref=eda>; AVAILABILITY: In Stock; CHECK_PRICES: https://www.snapeda.com/parts/STM32H743VIT6/STMicroelectronics/view-part/?ref=eda; DESCRIPTION: ARM® Cortex®-M7 STM32H7 Microcontroller IC 32-Bit Single-Core 480MHz 2MB (2M x 8) FLASH 100-LQFP (14x14); JLCPCB: C114409; MF: STMicroelectronics; MP: STM32H743VIT6; PACKAGE: LQFP-100 STMicroelectronics; PRICE: None; SNAPEDA_LINK: https://www.snapeda.com/parts/STM32H743VIT6/STMicroelectronics/view-part/?ref=snap
U2 = REF3033AIDBZR:REF3033AIDBZR: CMOS VOLTAGE REFERENCE Check availability <https://pricing.snapeda.com/parts/REF3033AIDBZR/Texas%20Instruments/view-part?ref=eda>; AVAILABILITY: In Stock; CHECK_PRICES: https://www.snapeda.com/parts/REF3033AIDBZR/Texas+Instruments/view-part/?ref=eda; DESCRIPTION: 3.3-V, 50-ppm/°C, 50-µA in 3-pin SOT-23 package series (bandgap) voltage reference; JLCPCB: C36658; MF: Texas Instruments; MP: REF3033AIDBZR; PACKAGE: SOT-23-3 Texas Instruments; PRICE: None; SNAPEDA_LINK: https://www.snapeda.com/parts/REF3033AIDBZR/Texas+Instruments/view-part/?ref=snap
U3 U6 U9 = UCC27211AQDDARQ1:UCC27211AQDDARQ1: 120-V Boot, 4-A Peak, High-Frequency High-Side and Low-Side Driver Source: Datasheet <http://www.ti.com/lit/gpn/ucc27211a-q1>; DESCRIPTION: 120-V Boot, 4-A Peak, High-Frequency High-Side and Low-Side Driver; HEIGHT: 1.7mm; JLCPCB: C485921; MANUFACTURER_NAME: Texas Instruments; MANUFACTURER_PART_NUMBER: UCC27211AQDDARQ1; MOUSER_PART_NUMBER: 595-UCC27211AQDDARQ1; MOUSER_PRICE-STOCK: https://www.mouser.co.uk/ProductDetail/Texas-Instruments/UCC27211AQDDARQ1?qs=n%252BTO0c4TDSYQNOcAHEGCfA%3D%3D
U4 U5 U7 U8 U10 U11 = SN74LVC1G08DBVR:SN74LVC1G08DBVR: Check availability <https://pricing.snapeda.com/parts/SN74LVC1G08DBVR/Texas%20Instruments/view-part?ref=eda>; AVAILABILITY: In Stock; CHECK_PRICES: https://www.snapeda.com/parts/SN74LVC1G08DBVR/Texas+Instruments/view-part/?ref=eda; DESCRIPTION: 1-ch, 2-input 1.65-V to 5.5-V 32 mA drive strength AND gate; JLCPCB: C7666; MF: Texas Instruments; MP: SN74LVC1G08DBVR; PACKAGE: SOT-23-5 Texas Instruments; PRICE: None; SNAPEDA_LINK: https://www.snapeda.com/parts/SN74LVC1G08DBVR/Texas+Instruments/view-part/?ref=snap
U12 = L78M12CDT-TR:L78M12CDT-TR: Linear Voltage Regulator IC 1 Output 500mA DPAK Check availability <https://pricing.snapeda.com/parts/L78M12CDT-TR/STMicroelectronics/view-part?ref=eda>; AVAILABILITY: In Stock; CHECK_PRICES: https://www.snapeda.com/parts/L78M12CDT-TR/STMicroelectronics/view-part/?ref=eda; DESCRIPTION: Linear Voltage Regulator IC Positive Fixed 1 Output 500mA DPAK; JLCPCB: C16424; MF: STMicroelectronics; MP: L78M12CDT-TR; PACKAGE: DPAK STMicroelectronics; PRICE: None; SNAPEDA_LINK: https://www.snapeda.com/parts/L78M12CDT-TR/STMicroelectronics/view-part/?ref=snap
U13 = AMS1117-3.3:AMS1117-3.3: Check availability <https://pricing.snapeda.com/parts/AMS1117-3.3/Advanced%20Monolithic%20Systems/view-part?ref=eda>; AVAILABILITY: Not in stock; CHECK_PRICES: https://www.snapeda.com/parts/AMS1117-3.3/Advanced+Monolithic+Systems/view-part/?ref=eda; DESCRIPTION: Sot223/Pkg 1-Amp 3.3-Volt Low Drop Out Voltage Regulatator; JLCPCB: C6186; MF: Advanced Monolithic Systems; MP: AMS1117-3.3; PACKAGE: SOT-223 Seeed Technology; PRICE: None; SNAPEDA_LINK: https://www.snapeda.com/parts/AMS1117-3.3/Advanced+Monolithic+Systems/view-part/?ref=snap
U17 = SN74LVC1G86DBVR:SN74LVC1G86DBVR: Check availability <https://pricing.snapeda.com/parts/SN74LVC1G86DBVR/Texas%20Instruments/view-part?ref=eda>; AVAILABILITY: In Stock; CHECK_PRICES: https://www.snapeda.com/parts/SN74LVC1G86DBVR/Texas+Instruments/view-part/?ref=eda; DESCRIPTION: Single 2-input, 1.65-V to 5.5-V XOR (exclusive OR) gate; JLCPCB: C402161; MF: Texas Instruments; MP: SN74LVC1G86DBVR; PACKAGE: SOT-23-5 Texas Instruments; PRICE: None; SNAPEDA_LINK: https://www.snapeda.com/parts/SN74LVC1G86DBVR/Texas+Instruments/view-part/?ref=snap
Y1 = Cristal_STM32:CRISTAL_25MHZ_3225: Crystals 25.000MHz 18pF 20ppm -20 to +70 Source: Datasheet <https://componentsearchengine.com/Datasheets/1/FL2500047.pdf>; DESCRIPTION: Crystals 25.000MHz 18pF 20ppm -20 to +70; HEIGHT: 0.78mm; JLCPCB: C9006; MANUFACTURER_NAME: Diodes Inc.; MANUFACTURER_PART_NUMBER: FL2500047; MOUSER_PART_NUMBER: 729-FL2500047; MOUSER_PRICE-STOCK: https://www.mouser.com/Search/Refine.aspx?Keyword=729-FL2500047

## Net classes
0 default: width 0.152 mm, drill 0.3 mm
1 signal: width 0.152 mm, drill 0.3 mm